# EAGLE schematic altmotor2 (EAGLE 7.5.0)
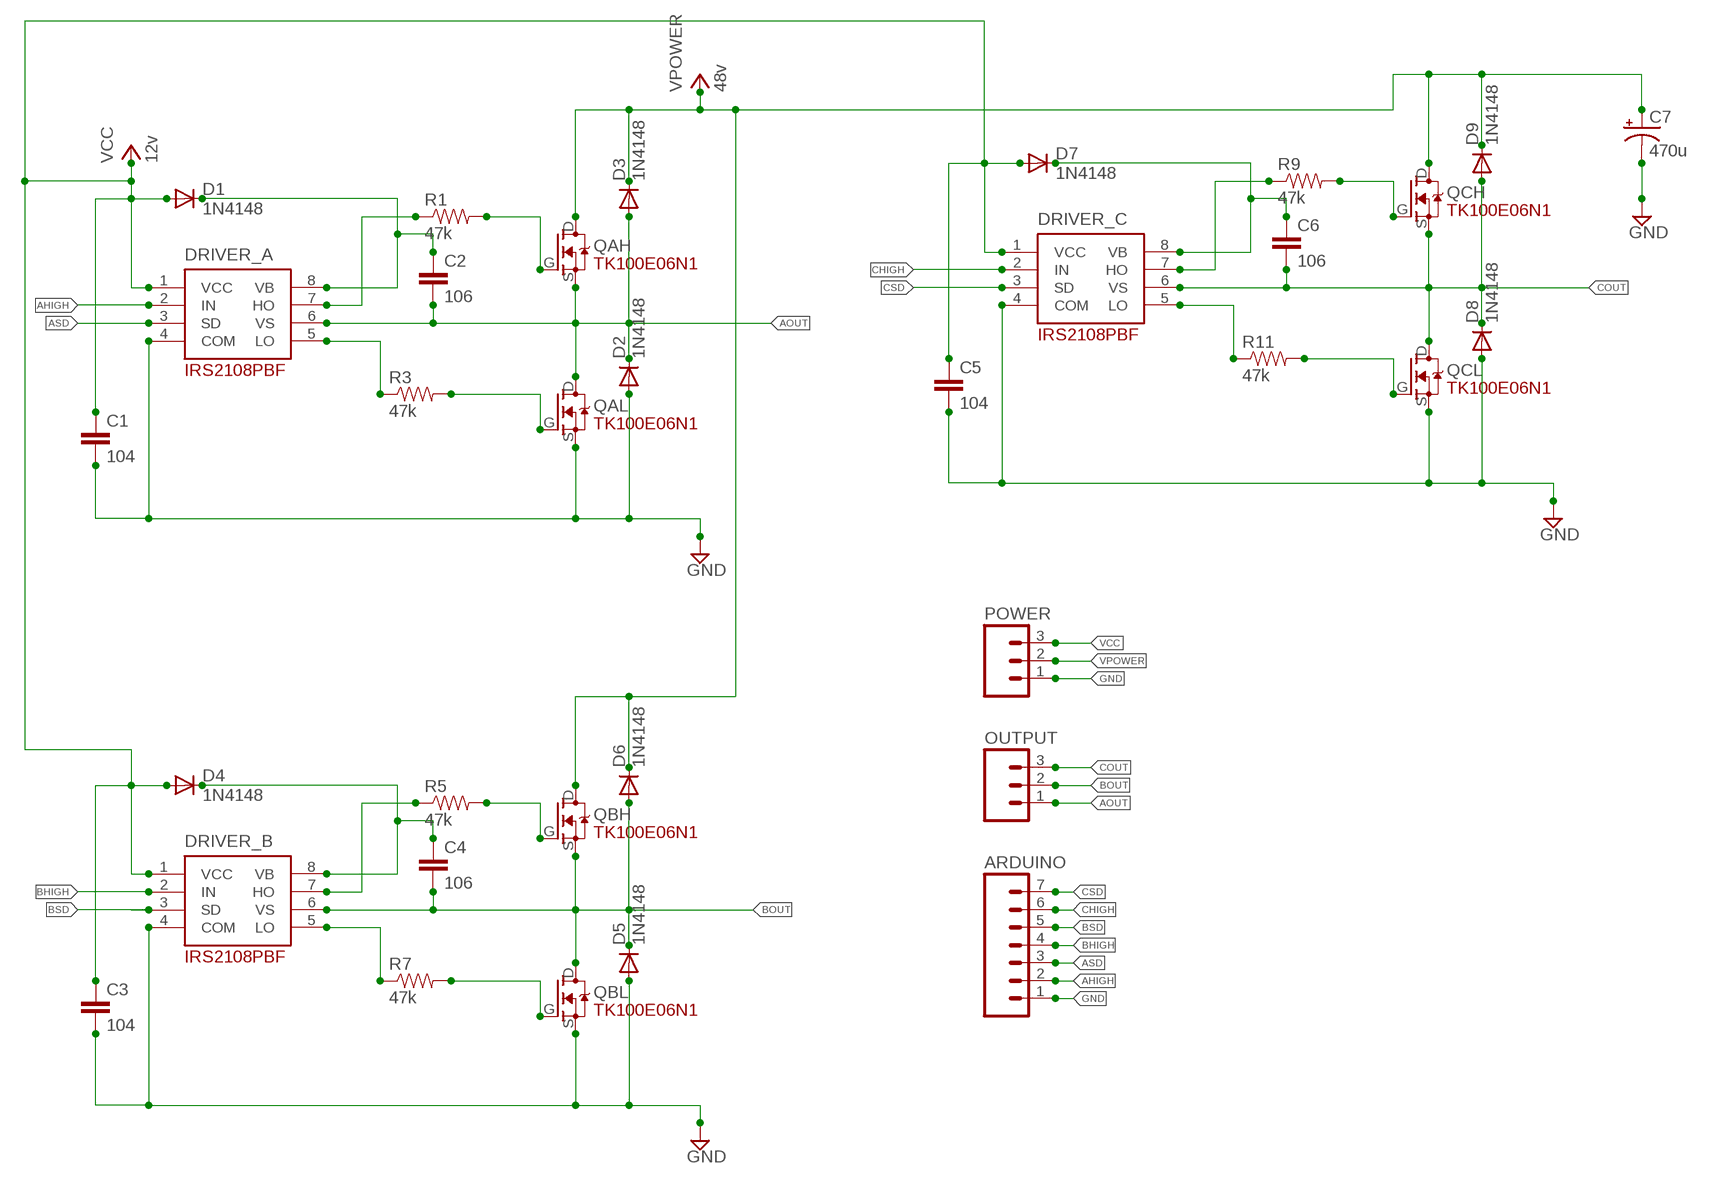
[diagram p0: schematic, sheet 1]

## Parts
ARDUINO  M07LONGPADS  [1X07_LONGPADS]
C1  104  CAPPTH1  [CAP-PTH-5MM]
C2  106  CAPPTH1  [CAP-PTH-5MM]
C3  104  CAPPTH1  [CAP-PTH-5MM]
C4  106  CAPPTH1  [CAP-PTH-5MM]
C5  104  CAPPTH1  [CAP-PTH-5MM]
C6  106  CAPPTH1  [CAP-PTH-5MM]
C7  470u  CPOL-USE10-20  [EB20D]
D1  1N4148  DIODEPTH  [DIODE-1N4001]
D2  1N4148  DIODEPTH  [DIODE-1N4001]
D3  1N4148  DIODEPTH  [DIODE-1N4001]
D4  1N4148  DIODEPTH  [DIODE-1N4001]
D5  1N4148  DIODEPTH  [DIODE-1N4001]
D6  1N4148  DIODEPTH  [DIODE-1N4001]
D7  1N4148  DIODEPTH  [DIODE-1N4001]
D8  1N4148  DIODEPTH  [DIODE-1N4001]
D9  1N4148  DIODEPTH  [DIODE-1N4001]
DRIVER_A  IRS2108PBF  [DIL08]
DRIVER_B  IRS2108PBF  [DIL08]
DRIVER_C  IRS2108PBF  [DIL08]
OUTPUT  TBLOCK-3  [TBLOCK-3]
POWER  TBLOCK-3  [TBLOCK-3]
QAH  TK100E06N1  [TO-220-2]
QAL  TK100E06N1  [TO-220-2]
QBH  TK100E06N1  [TO-220-2]
QBL  TK100E06N1  [TO-220-2]
QCH  TK100E06N1  [TO-220-2]
QCL  TK100E06N1  [TO-220-2]
R1  47k  RESISTORAXIAL-0.3  [AXIAL-0.3]
R3  47k  RESISTORAXIAL-0.3  [AXIAL-0.3]
R5  47k  RESISTORAXIAL-0.3  [AXIAL-0.3]
R7  47k  RESISTORAXIAL-0.3  [AXIAL-0.3]
R9  47k  RESISTORAXIAL-0.3  [AXIAL-0.3]
R11  47k  RESISTORAXIAL-0.3  [AXIAL-0.3]

## Nets
AHIGH: ARDUINO.2 DRIVER_A.2(IN)
AOUT: C2.2 D2.C D3.A DRIVER_A.6(VS) OUTPUT.1 QAH.S QAL.D
ASD: ARDUINO.3 DRIVER_A.3(SD)
BHIGH: ARDUINO.4 DRIVER_B.2(IN)
BOUT: C4.2 D5.C D6.A DRIVER_B.6(VS) OUTPUT.2 QBH.S QBL.D
BSD: ARDUINO.5 DRIVER_B.3(SD)
CHIGH: ARDUINO.6 DRIVER_C.2(IN)
COUT: C6.2 D8.C D9.A DRIVER_C.6(VS) OUTPUT.3 QCH.S QCL.D
CSD: ARDUINO.7 DRIVER_C.3(SD)
GND: ARDUINO.1 C1.2 C3.2 C5.2 C7.- D2.A D5.A D8.A DRIVER_A.4(COM) DRIVER_B.4(COM) DRIVER_C.4(COM) POWER.1 QAL.S QBL.S QCL.S
N$1: C2.1 D1.C DRIVER_A.8(VB)
N$2: C4.1 D4.C DRIVER_B.8(VB)
N$3: DRIVER_A.7(HO) R1.P$1
N$4: QAH.G R1.P$2
N$5: DRIVER_A.5(LO) R3.P$1
N$6: QAL.G R3.P$2
N$7: DRIVER_B.7(HO) R5.P$1
N$8: QBL.G R7.P$2
N$9: DRIVER_B.5(LO) R7.P$1
N$10: QBH.G R5.P$2
N$11: C6.1 D7.C DRIVER_C.8(VB)
N$12: DRIVER_C.7(HO) R9.P$1
N$13: QCH.G R9.P$2
N$14: DRIVER_C.5(LO) R11.P$1
N$15: QCL.G R11.P$2
VCC: C1.1 C3.1 C5.1 D1.A D4.A D7.A DRIVER_A.1(VCC) DRIVER_B.1(VCC) DRIVER_C.1(VCC) POWER.3 ; supply symbol labelled 12v
VPOWER: C7.+ D3.C D6.C D9.C POWER.2 QAH.D QBH.D QCH.D ; supply symbol labelled 48v

## Library data of the parts
ARDUINO = SparkFun:M07: Header 7 Standard 7-pin 0.1" header. Use with straight break away headers (SKU : PRT-00116), right angle break away headers (PRT-00553), swiss pins (PRT-00743), machine pins (PRT-00117), and female headers (PRT-00115). NOTES ON THE VARIANTS LOCK and LOCK_LONGPADS... This footprint was designed to help hold the alignment of a through-hole component (i.e. 7-pin header) while soldering it into place. You may notice that each hole has been shifted either up or down by 0.005 of an inch from it's more standard position (which is usually a perfectly straight line). This slight alteration caused the pins (the squares in the middle) to touch the edges of the holes. Because they are alternating, it causes a "brace" to hold the header in place. 0.005 has proven to be the perfect amount of "off-center" position when using our standard breakaway headers. Although looks a little odd when you look at the bare footprint, once you have a header in there, the alteration is very hard to notice. Also, if you push a header all the way into place, it is covered up entirely on the bottom side. This idea of altering the position of holes to aid alignment will be further integrated into the Sparkfun Library for other footprints. It can help hold any component with 3 or more connection pins.
C1-C6 = SparkFun:CAP: Capacitor Standard 0603 ceramic capacitor, and 0.1" leaded capacitor.
C7 = adafruit:CPOL-US: POLARIZED CAPACITOR, American symbol
D1-D9 = SparkFun:DIODE: Diode These are standard reverse protection diodes and small signal diodes. SMA package can handle up to about 1A. SOD-323 can handle about 200mA. What the SOD-323 package when ordering, there are some mfgs out there that are 5-pin packages.
DRIVER_A DRIVER_B DRIVER_C = ir:IRS2108PBF: Half bridge driver IRS2108PBF
OUTPUT POWER = akizuki_MOSFET:TBLOCK-3: Terminal block 3 pin block akizuki
QAH QAL QBH QBL QCH QCL = akizuki_MOSFET:TK100E06N1: N-ch MOSFET TK10006N1 akizuki
R1 R3 R5 R7 R9 R11 = SparkFun:RESISTOR: Resistor Basic schematic elements and footprints for 0603, 1206, and PTH resistors.